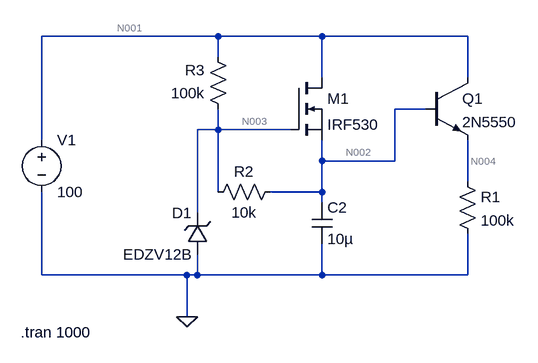
[diagram p0: schematic 10_V_source.asc]
10_V_source.asc, the LTspice schematic file:
Version 4
SHEET 1 1168 680
WIRE 416 -144 144 -144
WIRE 576 -144 416 -144
WIRE 800 -144 576 -144
WIRE 416 -112 416 -144
WIRE 576 -80 576 -144
WIRE 800 -80 800 -144
WIRE 736 -32 688 -32
WIRE 416 0 416 -32
WIRE 416 0 384 0
WIRE 528 0 416 0
WIRE 144 16 144 -144
WIRE 576 48 576 16
WIRE 688 48 688 -32
WIRE 688 48 576 48
WIRE 800 80 800 16
WIRE 416 96 416 0
WIRE 576 96 576 48
WIRE 576 96 496 96
WIRE 576 112 576 96
WIRE 384 128 384 0
WIRE 144 224 144 96
WIRE 368 224 144 224
WIRE 384 224 384 192
WIRE 384 224 368 224
WIRE 576 224 576 176
WIRE 576 224 384 224
WIRE 800 224 800 160
WIRE 800 224 576 224
WIRE 368 288 368 224
FLAG 368 288 0
SYMBOL voltage 144 0 R0
WINDOW 123 0 0 Left 2
WINDOW 39 0 0 Left 2
SYMATTR InstName V1
SYMATTR Value 100
SYMBOL nmos 528 -80 R0
SYMATTR InstName M1
SYMATTR Value IRF530
SYMBOL res 512 80 R90
WINDOW 0 0 56 VBottom 2
WINDOW 3 32 56 VTop 2
SYMATTR InstName R2
SYMATTR Value 10k
SYMBOL cap 560 112 R0
SYMATTR InstName C2
SYMATTR Value 10µ
SYMBOL res 432 -16 R180
WINDOW 0 36 76 Left 2
WINDOW 3 36 40 Left 2
SYMATTR InstName R3
SYMATTR Value 100k
SYMBOL zener 400 192 R180
WINDOW 0 24 64 Left 2
WINDOW 3 24 0 Left 2
SYMATTR InstName D1
SYMATTR Value EDZV12B
SYMBOL res 784 64 R0
SYMATTR InstName R1
SYMATTR Value 100k
SYMBOL npn 736 -80 R0
SYMATTR InstName Q1
SYMATTR Value 2N5550
TEXT 112 312 Left 2 !.tran 1000

The netlist it stands for:
* 10_V_source.asc
V1 N001 0 100
M1 N001 N003 N002 N002 IRF530
R2 N002 N003 10k
C2 N002 0 10µ
R3 N003 N001 100k
D1 0 N003 EDZV12B
R1 N004 0 100k
Q1 N001 N002 N004 0 2N5550
.model D D
.lib standard.dio
.model NPN NPN
.model PNP PNP
.lib standard.bjt
.model NMOS NMOS
.model PMOS PMOS
.lib standard.mos
.tran 1000
.backanno
.end

* Results of the author's LTspice run, read from the files saved beside the schematic
* Operating Point, zero values left out:
*   V(n001) = 100 V
*   V(n003) = 11.98 V
*   V(n002) = 11.97 V
*   V(n004) = 11.35 V
*   Ic(Q1) = 112.6 µA
*   Ib(Q1) = 859.1 nA
*   Ie(Q1) = -113.5 µA
*   Id(M1) = 139.7 pA
*   Is(M1) = -139.7 pA
*   I(D1) = -879.4 µA
*   I(R1) = 113.5 µA
*   I(R3) = -880.2 µA
*   I(R2) = -858.8 nA
*   I(V1) = -992.9 µA